# Altium schematic sheet Con485.SchDoc
size A4
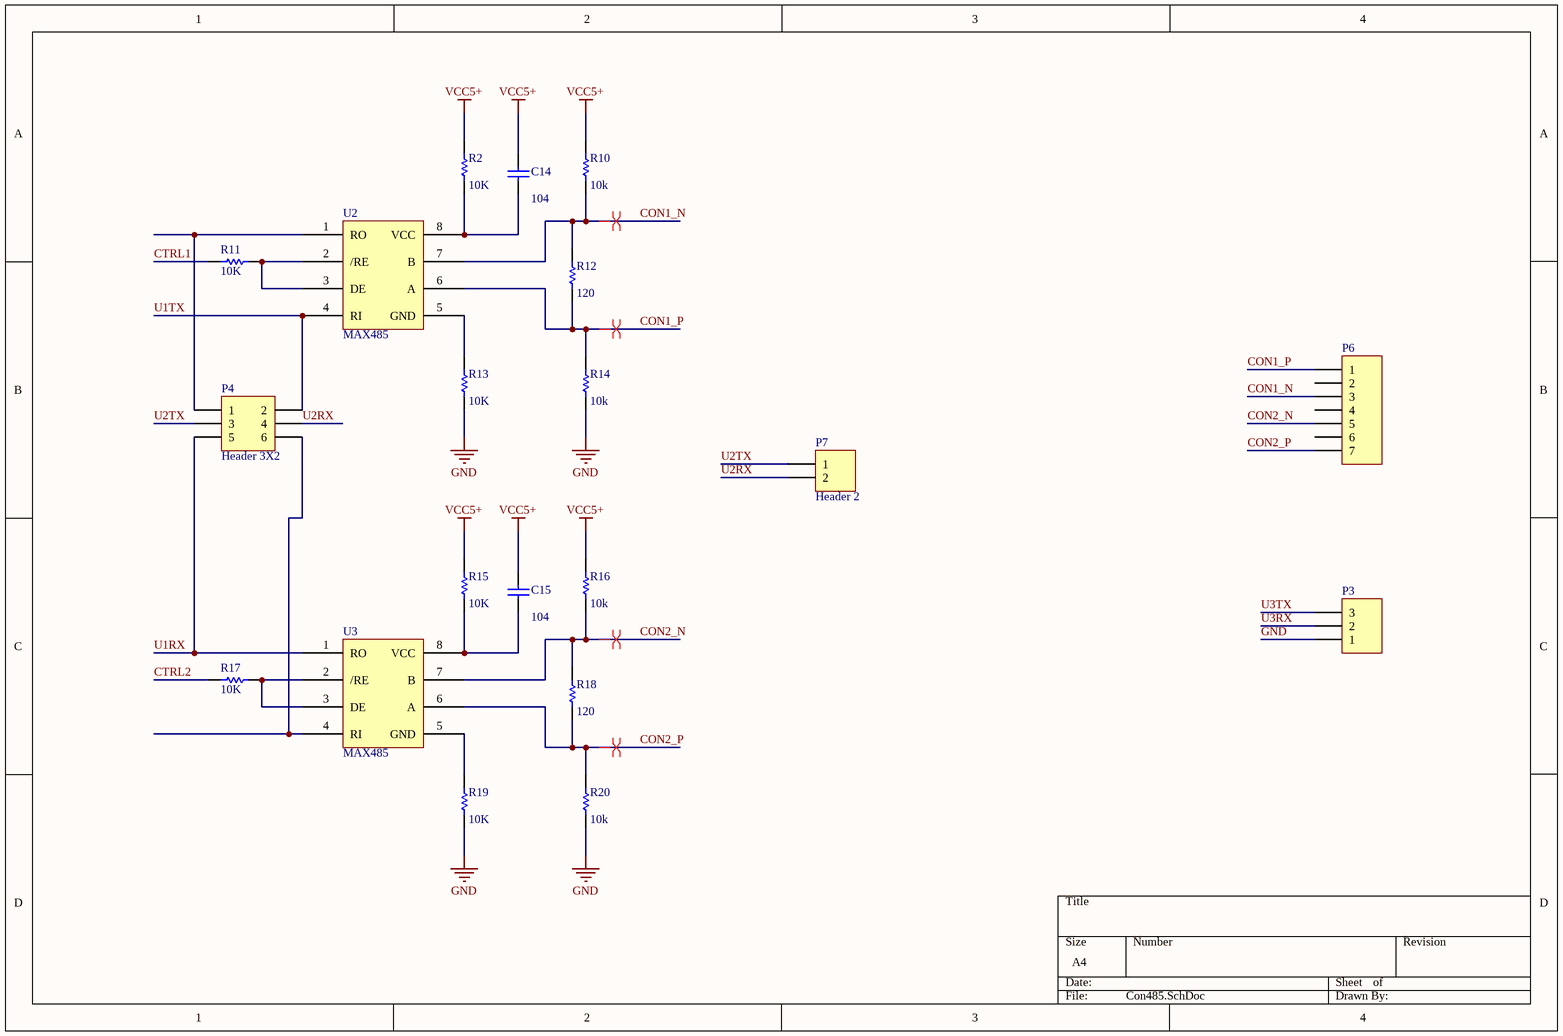
[diagram p0: Con485.SchDoc]

## Parts
C14  value 104  [CAPC3216L]  (hidden comment: Cap Semi)
C15  value 104  [CAPC3216L]  (hidden comment: Cap Semi)
P3  Header 3  [HDR1X3]  (value not drawn)
P4  Header 3X2  [HDR2X3]
P6  Header 7  [HDR1X7]  (value not drawn)
P7  Header 2  [HDR1X2]
R2  value 10K  [RESC3216L]  (hidden comment: Res Semi)
R10  value 10k  [RESC3216L]  (hidden comment: Res Semi)
R11  value 10K  [RESC3216L]  (hidden comment: Res Semi)
R12  value 120  [RESC3216L]  (hidden comment: Res Semi)
R13  value 10K  [RESC3216L]  (hidden comment: Res Semi)
R14  value 10k  [RESC3216L]  (hidden comment: Res Semi)
R15  value 10K  [RESC3216L]  (hidden comment: Res Semi)
R16  value 10k  [RESC3216L]  (hidden comment: Res Semi)
R17  value 10K  [RESC3216L]  (hidden comment: Res Semi)
R18  value 120  [RESC3216L]  (hidden comment: Res Semi)
R19  value 10K  [RESC3216L]  (hidden comment: Res Semi)
R20  value 10k  [RESC3216L]  (hidden comment: Res Semi)
U2  MAX485  [SO8]
U3  MAX485  [SO8]

## Nets
GND: P3.1 R13.1 R14.1 R19.1 R20.1
VCC5+: C14.2 C15.2 R2.2 R10.2 R15.2 R16.2
CON1_N: P6.3 R10.1 R12.2 U2.7(B)
CON1_P: P6.1 R12.1 R14.2 U2.6(A)
CON2_N: P6.5 R16.1 R18.2 U3.7(B)
CON2_P: P6.7 R18.1 R20.2 U3.6(A)
CTRL1: R11.2
CTRL2: R17.2
U1RX: P4.5 U3.1(RO)
U1TX: P4.2 U2.4(RI)
U2RX: P4.4 P7.2
U2TX: P4.3 P7.1
U3RX: P3.2
U3TX: P3.3
NetC14_1: C14.1 R2.1 U2.8(VCC)
NetC15_1: C15.1 R15.1 U3.8(VCC)
NetP4_1: P4.1 U2.1(RO)
NetP4_6: P4.6 U3.4(RI)
NetR11_1: R11.1 U2.2(/RE) U2.3(DE)
NetR13_2: R13.2 U2.5(GND)
NetR17_1: R17.1 U3.2(/RE) U3.3(DE)
NetR19_2: R19.2 U3.5(GND)

Not connected (* = marked no-connect by the designer): P6 2 4 6

## Layout directives
differential pair: CON1_N, CON1_P, CON2_N, CON2_P

## Library data of the parts
C14 C15 = Cap Semi: Capacitor (Semiconductor SIM Model); Published: 8-Jun-2000; LatestRevisionDate: 29-May-2009; LatestRevisionNote: IPC-7351 Footprint Added.; PackageReference: C1206; Publisher: Altium Limited; PackageDescription: Chip Capacitor
P3 = Header 3: Header, 3-Pin; LatestRevisionDate: 17-Jul-2002; LatestRevisionNote: Re-released for DXP Platform.; Publisher: Altium Limited
P4 = Header 3X2: Header, 3-Pin, Dual row; LatestRevisionDate: 17-Jul-2002; LatestRevisionNote: Re-released for DXP Platform.; Publisher: Altium Limited
P6 = Header 7: Header, 7-Pin; LatestRevisionDate: 17-Jul-2002; LatestRevisionNote: Re-released for DXP Platform.; Publisher: Altium Limited
P7 = Header 2: Header, 2-Pin; LatestRevisionDate: 17-Jul-2002; LatestRevisionNote: Re-released for DXP Platform.; Publisher: Altium Limited
R2 R10-R20 = Res Semi: Semiconductor Resistor; Published: 8-Jun-2000; LatestRevisionDate: 17-Jul-2002; LatestRevisionNote: Re-released for DXP Platform.; PackageReference: AXIAL-0.5; Publisher: Altium Limited